# EAGLE schematic Arduino-DRA818V-TX (EAGLE 7.7.0)
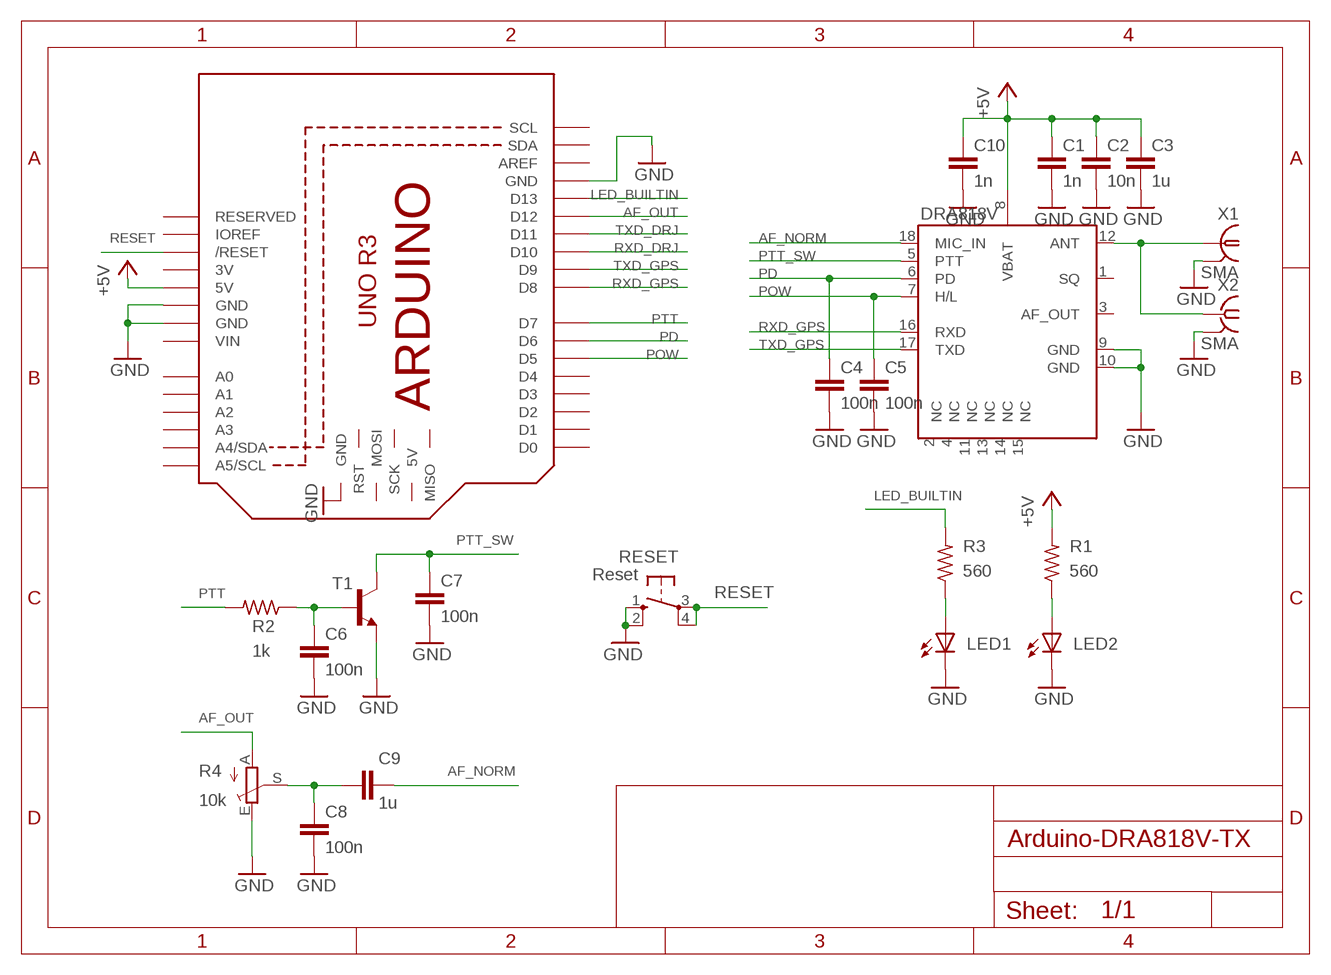
[diagram p0: schematic, sheet 1]

## Parts
C1  1n  C-EUC1206  [C1206]
C2  10n  C-EUC1206  [C1206]
C3  1u  C-EUC1206  [C1206]
C4  100n  C-EUC1206  [C1206]
C5  100n  C-EUC1206  [C1206]
C6  100n  C-EUC1206  [C1206]
C7  100n  C-EUC1206  [C1206]
C8  100n  C-EUC1206  [C1206]
C9  1u  C-EUC1206  [C1206]
C10  1n  C-EUC1206  [C1206]
DRA818V  DRA818A  [DRA818A]
LED1  LED3MM  [LED3MM]
LED2  LED3MM  [LED3MM]
M1  ARDUINO_R3_ICSP  [ARDUINOR3_ICSP]
R1  560  R-US_R1206  [R1206]
R2  1k  R-US_R1206  [R1206]
R3  560  R-US_R1206  [R1206]
R4  10k  TRIM_EU-CA6V  [CA6V]
RESET  Reset  10-XX  [B3F-10XX]
T1  MMBT3904LT1-NPN-SOT23-BEC  [SOT23-BEC]
X1  SMA  LTI-SASF54GT  [LTI-SASF54GT]
X2  SMA  SMA-142-0701-801/806  [J502-ND-142-0701-801/806]

## Nets
+5V: C1.1 C2.1 C3.1 C10.1 DRA818V.8(VBAT) M1.5V R1.2
AF_NORM: C9.2 DRA818V.18(MIC_IN)
AF_OUT: M1.D12 R4.A
GND: C1.2 C2.2 C3.2 C4.2 C5.2 C6.2 C7.2 C8.2 C10.2 DRA818V.9(GND) DRA818V.10(GND) LED1.K(C) LED2.K(C) M1.GND M1.GND@1(GND) M1.GND@2(GND) M1.GND@3(GND) R4.E RESET.1(S) RESET.2(S1) T1.E X1.2 X1.3 X1.4 X1.5 X2.G@1 X2.G@2 X2.G@3 X2.G@4
LED_BUILTIN: M1.D13 R3.2
N$5: DRA818V.12(ANT) X1.1 X2.1
N$7: C6.1 R2.1 T1.B
N$8: LED1.A R3.1
N$9: C8.1 C9.1 R4.S
N$41: LED2.A R1.1
PD: C4.1 DRA818V.6(PD) M1.D6
POW: C5.1 DRA818V.7(H/L) M1.D5
PTT: M1.D7 R2.2
PTT_SW: C7.1 DRA818V.5(PTT) T1.C
RESET: M1.RESET(/RESET) RESET.3(P) RESET.4(P1)
RXD_DRJ: M1.D10
RXD_GPS: DRA818V.16(RXD) M1.D8
TXD_DRJ: M1.D11
TXD_GPS: DRA818V.17(TXD) M1.D9
Unconnected: DRA818V.1(SQ) DRA818V.2(NC) DRA818V.3(AF_OUT) DRA818V.4(NC) DRA818V.11(NC) DRA818V.13(NC) DRA818V.14(NC) DRA818V.15(NC) M1.5V_ICSP(5V) M1.A0 M1.A1 M1.A2 M1.A3 M1.A4(A4/SDA) M1.A5(A5/SCL) M1.AREF M1.D0 M1.D1 M1.D2 M1.D3 M1.D4 M1.IOREF M1.MISO M1.MOSI M1.RESERVED M1.RESET_ICSP(RST) M1.SCK M1.SCL M1.SDA

## Power pins joined to a net without a drawn wire
3V: M1.3V
VIN: M1.VIN

## Library data of the parts
C1-C10 = resistor:C-EU: CAPACITOR, European symbol
DRA818V = dorji:DRA818A
LED1 LED2 = adafruit:LED: LED OSRAM: - CHIPLED LG R971, LG N971, LY N971, LG Q971, LY Q971, LO R971, LY R971 LH N974, LH R974 LS Q976, LO Q976, LY Q976 LO Q996 - Hyper CHIPLED LW Q18S LB Q993, LB Q99A, LB R99A - SideLED LS A670, LO A670, LY A670, LG A670, LP A670 LB A673, LV A673, LT A673, LW A673 LH A674 LY A675 LS A676, LA A676, LO A676, LY A676, LW A676 LS A679, LY A679, LG A679 - Hyper Micro SIDELED® LS Y876, LA Y876, LO Y876, LY Y876 LT Y87S - SmartLED LW L88C, LW L88S LB L89C, LB L89S, LG L890 LS L89K, LO L89K, LY L89K LS L896, LA L896, LO L896, LY L896 - TOPLED LS T670, LO T670, LY T670, LG T670, LP T670 LSG T670, LSP T670, LSY T670, LOP T670, LYG T670 LG T671, LOG T671, LSG T671 LB T673, LV T673, LT T673, LW T673 LH T674 LS T676, LA T676, LO T676, LY T676, LB T676, LH T676, LSB T676, LW T676 LB T67C, LV T67C, LT T67C, LS T67K, LO T67K, LY T67K, LW E67C LS E67B, LA E67B, LO E67B, LY E67B, LB E67C, LV E67C, LT E67C LW T67C LS T679, LY T679, LG T679 LS T770, LO T770, LY T770, LG T770, LP T770 LB T773, LV T773, LT T773, LW T773 LH T774 LS E675, LA E675, LY E675, LS T675 LS T776, LA T776, LO T776, LY T776, LB T776 LHGB T686 LT T68C, LB T68C - Hyper Mini TOPLED® LB M676 - Mini TOPLED Santana® LG M470 LS M47K, LO M47K, LY M47K Source: http://www.osram.convergy.de/
M1 = adafruit:ARDUINO_R3_ICSP
R1-R3 = resistor:R-US_: RESISTOR, American symbol
R4 = pot:TRIM_EU-: POTENTIOMETER
RESET = switch-omron:10-XX: OMRON SWITCH; MPN: B3F-1000; OC_FARNELL: 176432; OC_NEWARK: 36M3542
T1 = transistor:*-NPN-: NPN Transistror BF959 corrected 2008.03.06
X1 = con-coax:LTI-SASF54GT: SMA vertical PCB thrue hole jack Source: Lighthorse Technologies, inc. SASF54GT.pdf; OC_FARNELL: unknown; OC_NEWARK: unknown
X2 = con-coax:SMA-: SMA 50 Ohm End Launch Jack Receptacle - Round Contact Johnson Components Source: www.johnsoncomponents.com .. J502-ND.pdf; MF: JOHNSON COMPONENTS; MPN: 142-0701-801; OC_FARNELL: 1608592; OC_NEWARK: 90F2624